# Altium project Ring Flex.PrjPcb
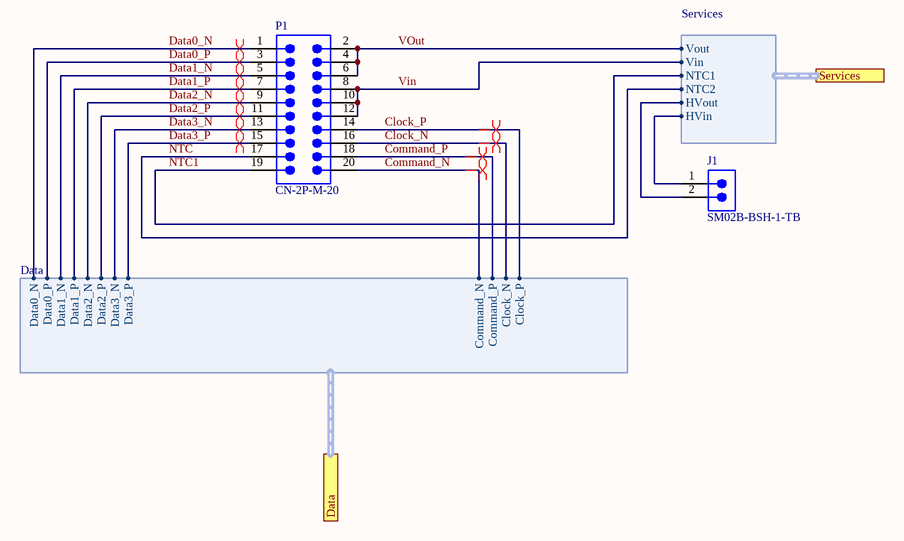
[diagram p0: Module Connector.SchDoc]
CERNProject: CERNProject; EDHNumber: EDHNumber; Group: PH-ADE-ID; ProjectAddress1: CH-1211 Genève 23 - Switzerland; ProjectOrganization: European Organization for Nuclear Research; ProjectTitle: ProjectTitle
3 sheets, 9 parts. Net scope: flat (ports and power ports of the same name join across sheets).
Board file: Ring Flex.PcbDoc
Sheets:
  Module Connector.SchDoc
  Ring Flex Connector.SchDoc
  Services.SchDoc

## Sheet Module Connector.SchDoc
size A

### Parts
(Parts that share a designator on the sheet are numbered #1, #2 ... from top to bottom, then left to right.)
J1  SM02B-BSH-1-TB  [SM02B-BSH-1-TB]
P1#1  CN-2P-M-20  [SLH-010-1.50-G-D-A]

### Ports
Data (harness Data), Services (harness Services)

### Harnesses
Services: Vin, Vout, HVin, HVout, NTC1, NTC2
Data: Data0_N, Data0_P, Data1_N, Data1_P, Data2_N, Data2_P, Data3_N, Data3_P, Clock_P, Clock_N, Command_P, Command_N

### Nets
Clock_N: P1#1.16 ; port Data.Clock_N
Clock_P: P1#1.14 ; port Data.Clock_P
Command_N: P1#1.20 ; port Data.Command_N
Command_P: P1#1.18 ; port Data.Command_P
Data0_N: P1#1.1 ; port Data.Data0_N
Data0_P: P1#1.3 ; port Data.Data0_P
Data1_N: P1#1.5 ; port Data.Data1_N
Data1_P: P1#1.7 ; port Data.Data1_P
Data2_N: P1#1.9 ; port Data.Data2_N
Data2_P: P1#1.11 ; port Data.Data2_P
Data3_N: P1#1.13 ; port Data.Data3_N
Data3_P: P1#1.15 ; port Data.Data3_P
NTC: P1#1.17 ; port Services.NTC2
NTC1: P1#1.19 ; port Services.NTC1
Vin: P1#1.8 P1#1.10 P1#1.12 ; port Services.Vin
VOut: P1#1.2 P1#1.4 P1#1.6 ; port Services.Vout
NetJ1_1: J1.1 ; port Services.HVin
NetJ1_2: J1.2 ; port Services.HVout

### Layout directives
differential pair: Clock_N, Clock_P, Command_N, Command_P, Data0_N, Data0_P, Data1_N, Data1_P, Data2_N, Data2_P, Data3_N, Data3_P

### Library data of the parts
J1 = CN-1S-M-2: 1 Row, Socket, 0 Mounting Holes, Male Pins, 2 Pins
P1#1 = CN-2P-M-20: Board-to-Board Connector, Vertical, 2-Row, Pitch 0.80mm, 20-Position, Male

## Sheet Ring Flex Connector.SchDoc
size A2
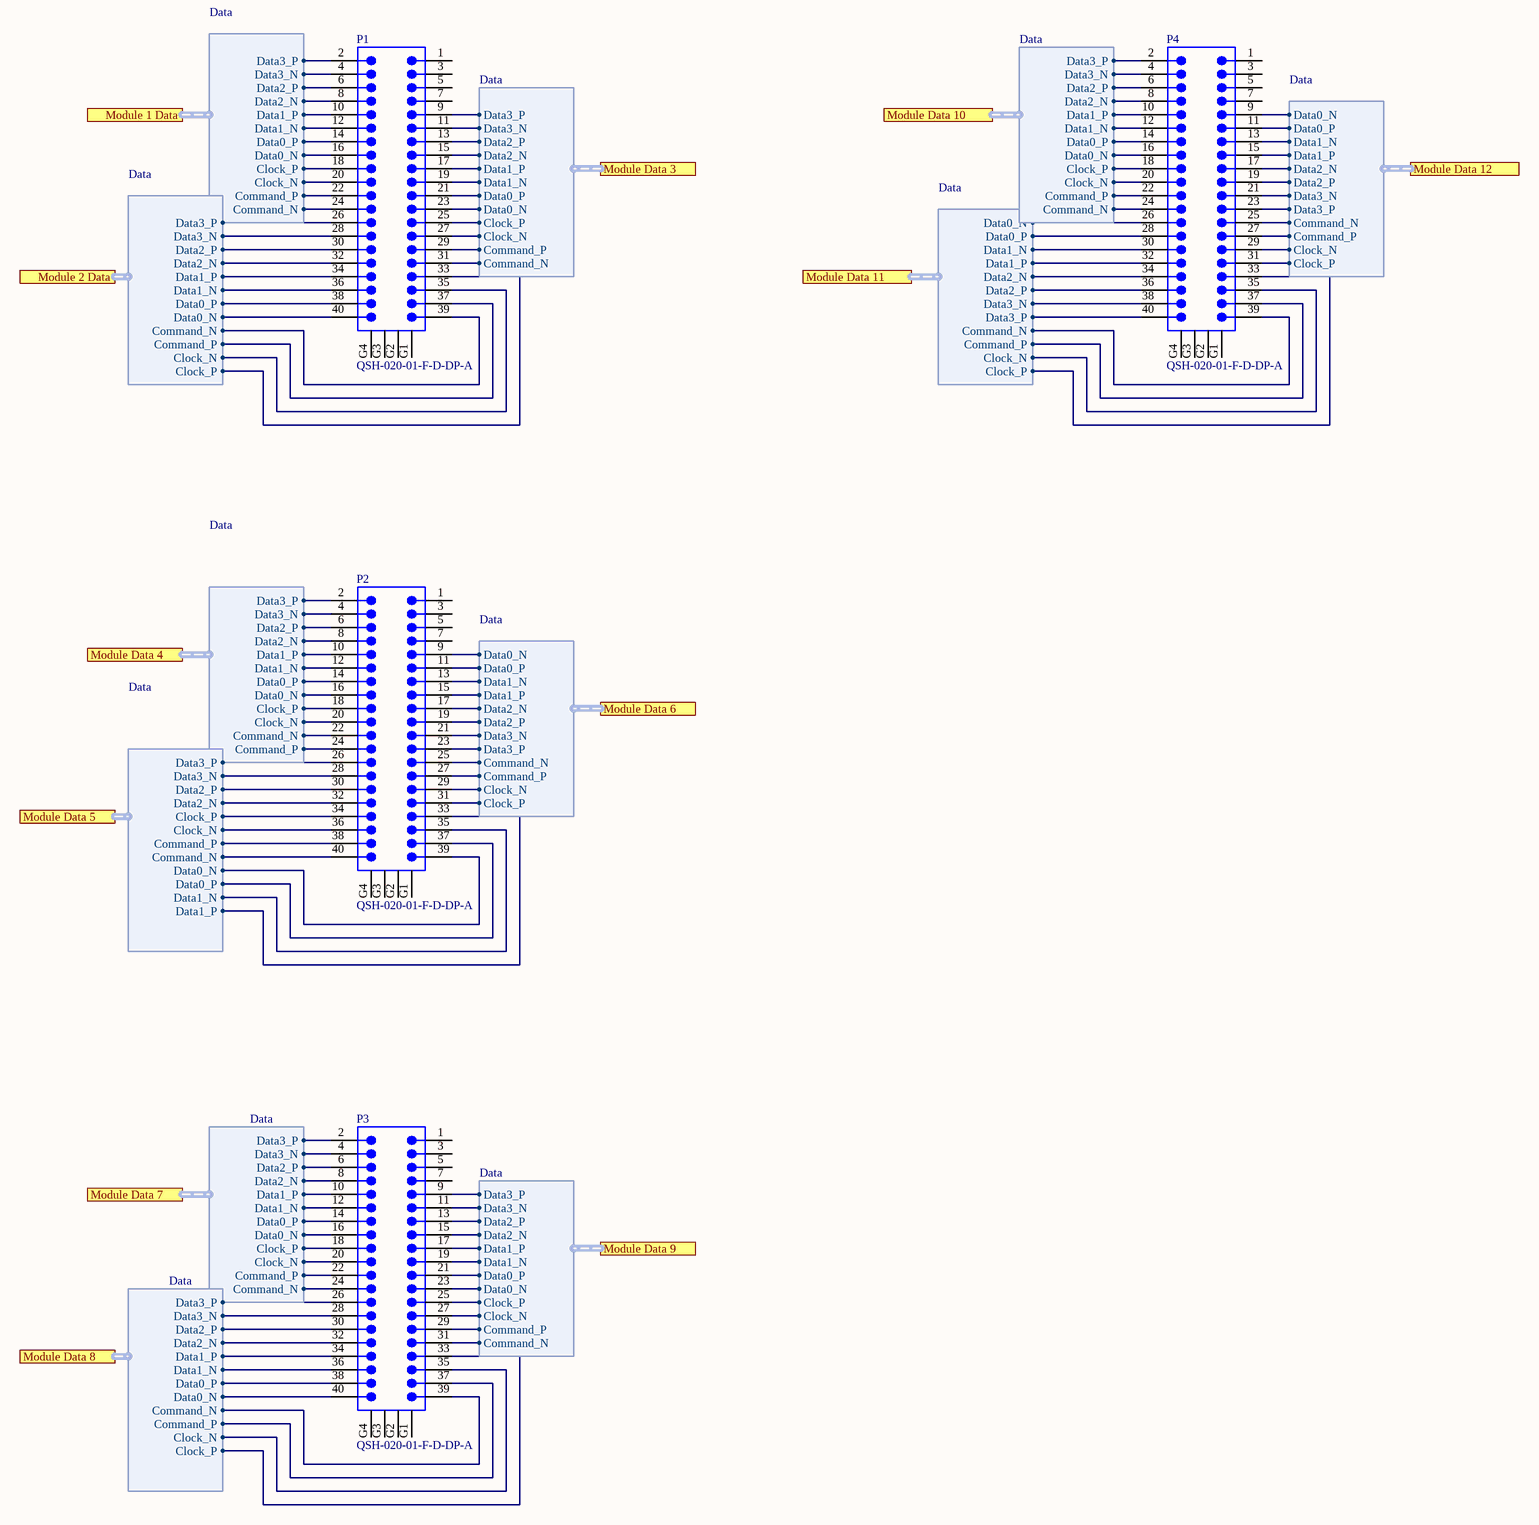
[diagram p1: Ring Flex Connector.SchDoc]

### Parts
(Parts that share a designator on the sheet are numbered #1, #2 ... from top to bottom, then left to right.)
P1#2  QSH-020-01-F-D-DP-A  [QSH-020-01-X-D-DP-A]
P2  QSH-020-01-F-D-DP-A  [QSH-020-01-X-D-DP-A]
P3  QSH-020-01-F-D-DP-A  [QSH-020-01-X-D-DP-A]
P4  QSH-020-01-F-D-DP-A  [QSH-020-01-X-D-DP-A]

### Ports
Module 1 Data (harness Data), Module 2 Data (harness Data), Module Data 3 (harness Data), Module Data 4 (harness Data), Module Data 5 (harness Data), Module Data 6 (harness Data), Module Data 7 (harness Data), Module Data 8 (harness Data), Module Data 9 (harness Data), Module Data 10 (harness Data), Module Data 11 (harness Data), Module Data 12 (harness Data)

### Harnesses
Data: Data0_N, Data0_P, Data1_N, Data1_P, Data2_N, Data2_P, Data3_N, Data3_P, Clock_P, Clock_N, Command_P, Command_N

### Nets
NetP1#2_2: P1#2.2 ; port Module 1 Data.Data3_P
NetP1#2_4: P1#2.4 ; port Module 1 Data.Data3_N
NetP1#2_6: P1#2.6 ; port Module 1 Data.Data2_P
NetP1#2_8: P1#2.8 ; port Module 1 Data.Data2_N
NetP1#2_9: P1#2.9 ; port Module Data 3.Data3_P
NetP1#2_10: P1#2.10 ; port Module 1 Data.Data1_P
NetP1#2_11: P1#2.11 ; port Module Data 3.Data3_N
NetP1#2_12: P1#2.12 ; port Module 1 Data.Data1_N
NetP1#2_13: P1#2.13 ; port Module Data 3.Data2_P
NetP1#2_14: P1#2.14 ; port Module 1 Data.Data0_P
NetP1#2_15: P1#2.15 ; port Module Data 3.Data2_N
NetP1#2_16: P1#2.16 ; port Module 1 Data.Data0_N
NetP1#2_17: P1#2.17 ; port Module Data 3.Data1_P
NetP1#2_18: P1#2.18 ; port Module 1 Data.Clock_P
NetP1#2_19: P1#2.19 ; port Module Data 3.Data1_N
NetP1#2_20: P1#2.20 ; port Module 1 Data.Clock_N
NetP1#2_21: P1#2.21 ; port Module Data 3.Data0_P
NetP1#2_22: P1#2.22 ; port Module 1 Data.Command_P
NetP1#2_23: P1#2.23 ; port Module Data 3.Data0_N
NetP1#2_24: P1#2.24 ; port Module 1 Data.Command_N
NetP1#2_25: P1#2.25 ; port Module Data 3.Clock_P
NetP1#2_26: P1#2.26 ; port Module 2 Data.Data3_P
NetP1#2_27: P1#2.27 ; port Module Data 3.Clock_N
NetP1#2_28: P1#2.28 ; port Module 2 Data.Data3_N
NetP1#2_29: P1#2.29 ; port Module Data 3.Command_P
NetP1#2_30: P1#2.30 ; port Module 2 Data.Data2_P
NetP1#2_31: P1#2.31 ; port Module Data 3.Command_N
NetP1#2_32: P1#2.32 ; port Module 2 Data.Data2_N
NetP1#2_33: P1#2.33 ; port Module 2 Data.Clock_P
NetP1#2_34: P1#2.34 ; port Module 2 Data.Data1_P
NetP1#2_35: P1#2.35 ; port Module 2 Data.Clock_N
NetP1#2_36: P1#2.36 ; port Module 2 Data.Data1_N
NetP1#2_37: P1#2.37 ; port Module 2 Data.Command_P
NetP1#2_38: P1#2.38 ; port Module 2 Data.Data0_P
NetP1#2_39: P1#2.39 ; port Module 2 Data.Command_N
NetP1#2_40: P1#2.40 ; port Module 2 Data.Data0_N
NetP2_2: P2.2 ; port Module Data 4.Data3_P
NetP2_4: P2.4 ; port Module Data 4.Data3_N
NetP2_6: P2.6 ; port Module Data 4.Data2_P
NetP2_8: P2.8 ; port Module Data 4.Data2_N
NetP2_9: P2.9 ; port Module Data 6.Data0_N
NetP2_10: P2.10 ; port Module Data 4.Data1_P
NetP2_11: P2.11 ; port Module Data 6.Data0_P
NetP2_12: P2.12 ; port Module Data 4.Data1_N
NetP2_13: P2.13 ; port Module Data 6.Data1_N
NetP2_14: P2.14 ; port Module Data 4.Data0_P
NetP2_15: P2.15 ; port Module Data 6.Data1_P
NetP2_16: P2.16 ; port Module Data 4.Data0_N
NetP2_17: P2.17 ; port Module Data 6.Data2_N
NetP2_18: P2.18 ; port Module Data 4.Clock_P
NetP2_19: P2.19 ; port Module Data 6.Data2_P
NetP2_20: P2.20 ; port Module Data 4.Clock_N
NetP2_21: P2.21 ; port Module Data 6.Data3_N
NetP2_22: P2.22 ; port Module Data 4.Command_N
NetP2_23: P2.23 ; port Module Data 6.Data3_P
NetP2_24: P2.24 ; port Module Data 4.Command_P
NetP2_25: P2.25 ; port Module Data 6.Command_N
NetP2_26: P2.26 ; port Module Data 5.Data3_P
NetP2_27: P2.27 ; port Module Data 6.Command_P
NetP2_28: P2.28 ; port Module Data 5.Data3_N
NetP2_29: P2.29 ; port Module Data 6.Clock_N
NetP2_30: P2.30 ; port Module Data 5.Data2_P
NetP2_31: P2.31 ; port Module Data 6.Clock_P
NetP2_32: P2.32 ; port Module Data 5.Data2_N
NetP2_33: P2.33 ; port Module Data 5.Data1_P
NetP2_34: P2.34 ; port Module Data 5.Clock_P
NetP2_35: P2.35 ; port Module Data 5.Data1_N
NetP2_36: P2.36 ; port Module Data 5.Clock_N
NetP2_37: P2.37 ; port Module Data 5.Data0_P
NetP2_38: P2.38 ; port Module Data 5.Command_P
NetP2_39: P2.39 ; port Module Data 5.Data0_N
NetP2_40: P2.40 ; port Module Data 5.Command_N
NetP3_2: P3.2 ; port Module Data 7.Data3_P
NetP3_4: P3.4 ; port Module Data 7.Data3_N
NetP3_6: P3.6 ; port Module Data 7.Data2_P
NetP3_8: P3.8 ; port Module Data 7.Data2_N
NetP3_9: P3.9 ; port Module Data 9.Data3_P
NetP3_10: P3.10 ; port Module Data 7.Data1_P
NetP3_11: P3.11 ; port Module Data 9.Data3_N
NetP3_12: P3.12 ; port Module Data 7.Data1_N
NetP3_13: P3.13 ; port Module Data 9.Data2_P
NetP3_14: P3.14 ; port Module Data 7.Data0_P
NetP3_15: P3.15 ; port Module Data 9.Data2_N
NetP3_16: P3.16 ; port Module Data 7.Data0_N
NetP3_17: P3.17 ; port Module Data 9.Data1_P
NetP3_18: P3.18 ; port Module Data 7.Clock_P
NetP3_19: P3.19 ; port Module Data 9.Data1_N
NetP3_20: P3.20 ; port Module Data 7.Clock_N
NetP3_21: P3.21 ; port Module Data 9.Data0_P
NetP3_22: P3.22 ; port Module Data 7.Command_P
NetP3_23: P3.23 ; port Module Data 9.Data0_N
NetP3_24: P3.24 ; port Module Data 7.Command_N
NetP3_25: P3.25 ; port Module Data 9.Clock_P
NetP3_26: P3.26 ; port Module Data 8.Data3_P
NetP3_27: P3.27 ; port Module Data 9.Clock_N
NetP3_28: P3.28 ; port Module Data 8.Data3_N
NetP3_29: P3.29 ; port Module Data 9.Command_P
NetP3_30: P3.30 ; port Module Data 8.Data2_P
NetP3_31: P3.31 ; port Module Data 9.Command_N
NetP3_32: P3.32 ; port Module Data 8.Data2_N
NetP3_33: P3.33 ; port Module Data 8.Clock_P
NetP3_34: P3.34 ; port Module Data 8.Data1_P
NetP3_35: P3.35 ; port Module Data 8.Clock_N
NetP3_36: P3.36 ; port Module Data 8.Data1_N
NetP3_37: P3.37 ; port Module Data 8.Command_P
NetP3_38: P3.38 ; port Module Data 8.Data0_P
NetP3_39: P3.39 ; port Module Data 8.Command_N
NetP3_40: P3.40 ; port Module Data 8.Data0_N
NetP4_2: P4.2 ; port Module Data 10.Data3_P
NetP4_4: P4.4 ; port Module Data 10.Data3_N
NetP4_6: P4.6 ; port Module Data 10.Data2_P
NetP4_8: P4.8 ; port Module Data 10.Data2_N
NetP4_9: P4.9 ; port Module Data 12.Data0_N
NetP4_10: P4.10 ; port Module Data 10.Data1_P
NetP4_11: P4.11 ; port Module Data 12.Data0_P
NetP4_12: P4.12 ; port Module Data 10.Data1_N
NetP4_13: P4.13 ; port Module Data 12.Data1_N
NetP4_14: P4.14 ; port Module Data 10.Data0_P
NetP4_15: P4.15 ; port Module Data 12.Data1_P
NetP4_16: P4.16 ; port Module Data 10.Data0_N
NetP4_17: P4.17 ; port Module Data 12.Data2_N
NetP4_18: P4.18 ; port Module Data 10.Clock_P
NetP4_19: P4.19 ; port Module Data 12.Data2_P
NetP4_20: P4.20 ; port Module Data 10.Clock_N
NetP4_21: P4.21 ; port Module Data 12.Data3_N
NetP4_22: P4.22 ; port Module Data 10.Command_P
NetP4_23: P4.23 ; port Module Data 12.Data3_P
NetP4_24: P4.24 ; port Module Data 10.Command_N
NetP4_25: P4.25 ; port Module Data 12.Command_N
NetP4_26: P4.26 ; port Module Data 11.Data0_N
NetP4_27: P4.27 ; port Module Data 12.Command_P
NetP4_28: P4.28 ; port Module Data 11.Data0_P
NetP4_29: P4.29 ; port Module Data 12.Clock_N
NetP4_30: P4.30 ; port Module Data 11.Data1_N
NetP4_31: P4.31 ; port Module Data 12.Clock_P
NetP4_32: P4.32 ; port Module Data 11.Data1_P
NetP4_33: P4.33 ; port Module Data 11.Clock_P
NetP4_34: P4.34 ; port Module Data 11.Data2_N
NetP4_35: P4.35 ; port Module Data 11.Clock_N
NetP4_36: P4.36 ; port Module Data 11.Data2_P
NetP4_37: P4.37 ; port Module Data 11.Command_P
NetP4_38: P4.38 ; port Module Data 11.Data3_N
NetP4_39: P4.39 ; port Module Data 11.Command_N
NetP4_40: P4.40 ; port Module Data 11.Data3_P

Not connected (* = marked no-connect by the designer): P1#2 1 3 5 7 G1 G2 G3 G4; P2 1 3 5 7 G1 G2 G3 G4; P3 1 3 5 7 G1 G2 G3 G4; P4 1 3 5 7 G1 G2 G3 G4

### Notes on the sheet
- Title
- Size:
- Date:
- File:
- A2
- Number:
- Time:
- Revision:
- Sheet
- of

### Library data of the parts
P1#2 P2-P4 = CN-2P-M-40: Board-to-Board Connector, Differnetial Pair, Vertical, 2-Row, Pitch 0.50mm, 40-Position, Male

## Sheet Services.SchDoc
size A0; Organization: Altium Limited; Address1: L3, 12a Rodborough Rd; Address2: Frenchs Forest; Address3: NSW; Address4: Australia 2086
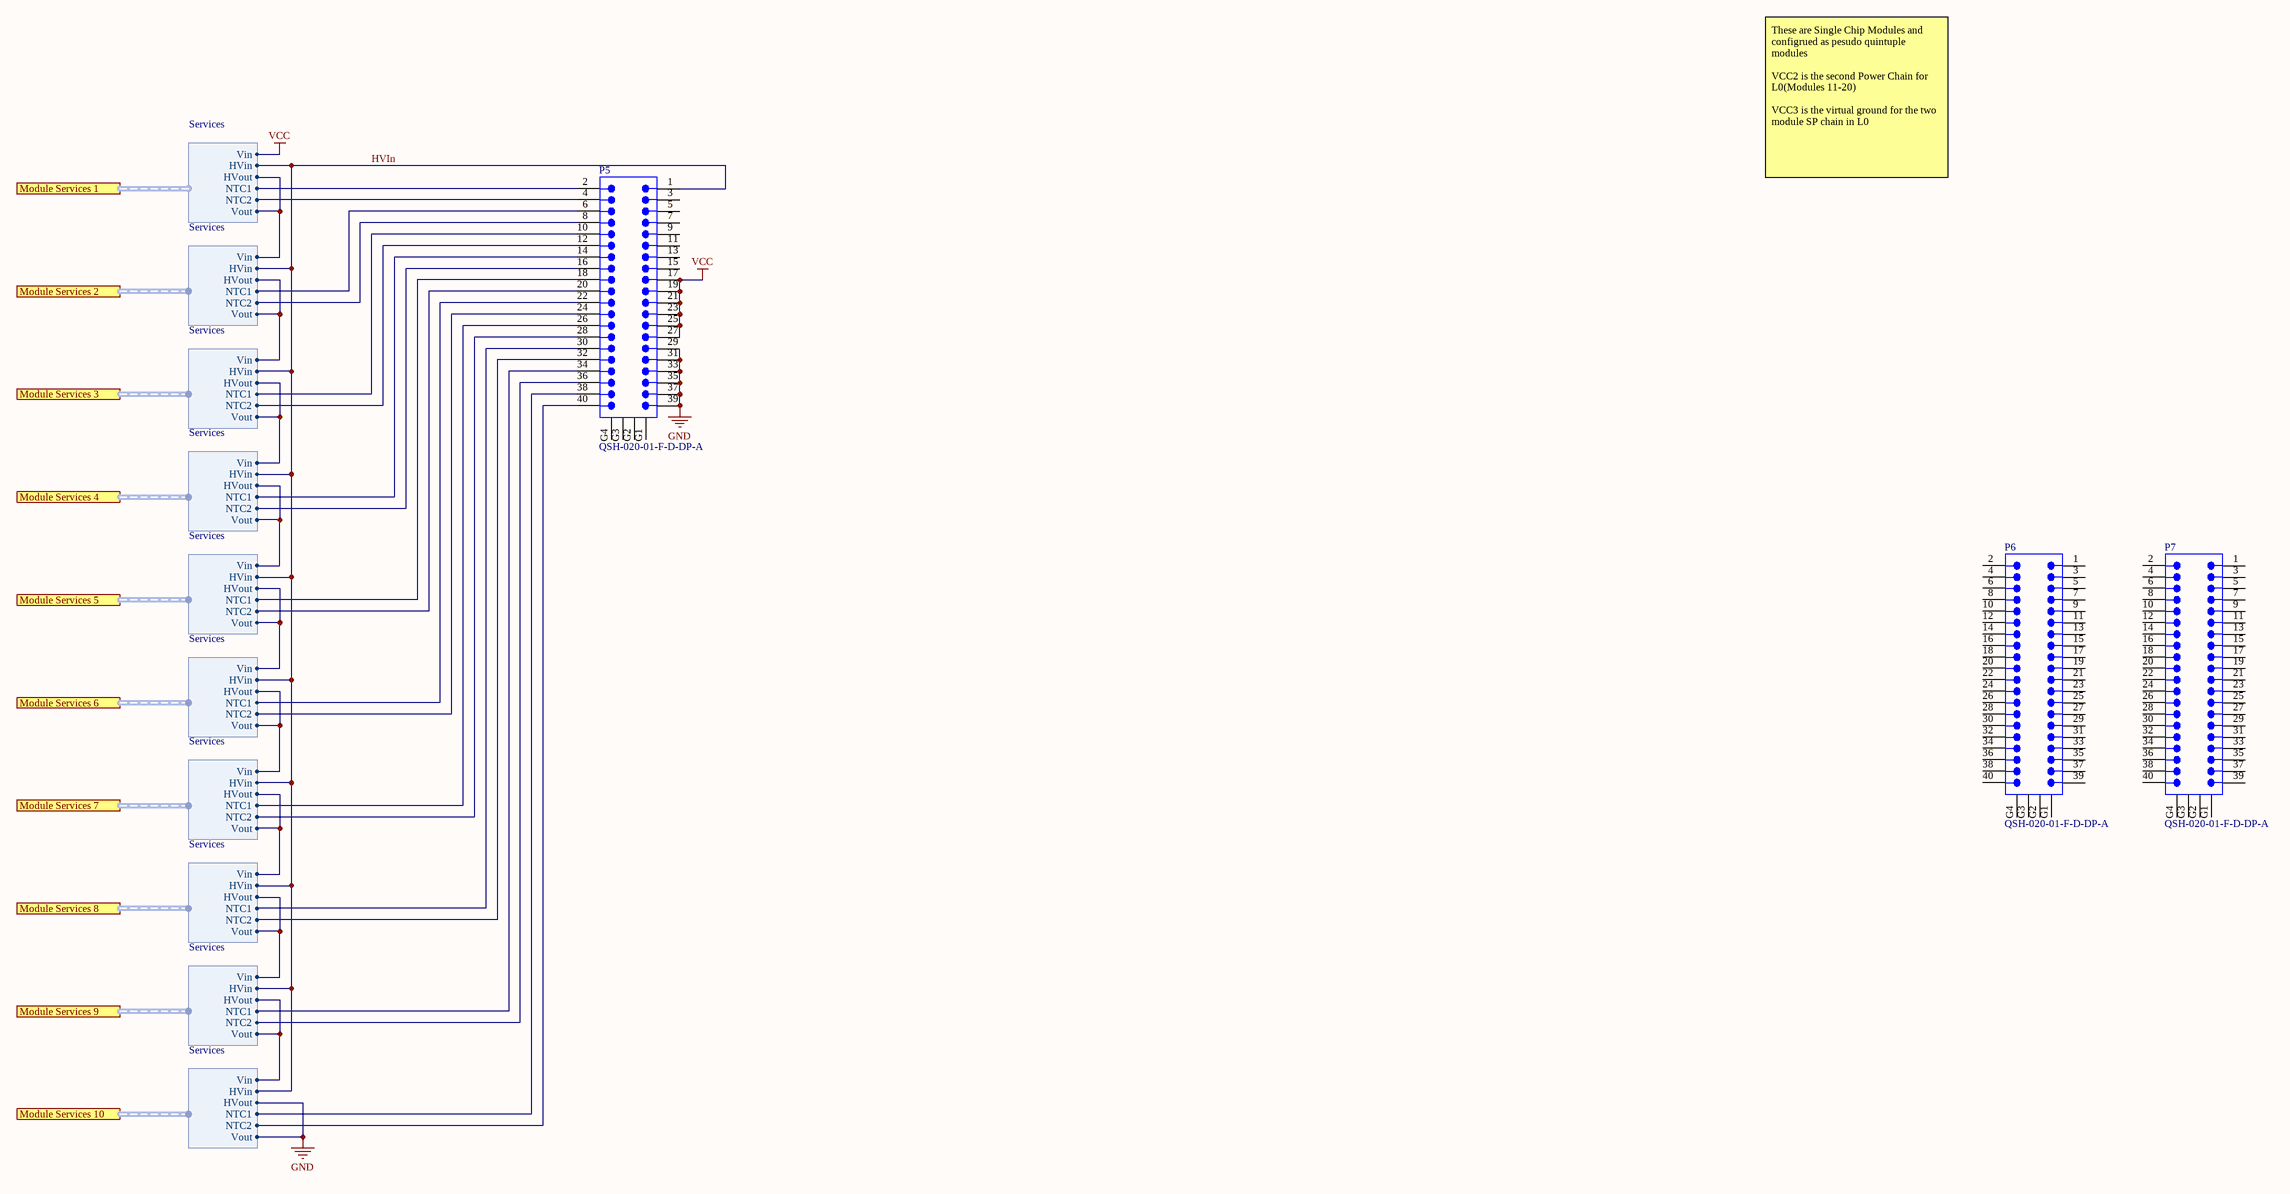
[diagram p2: Services.SchDoc]

### Parts
P5  QSH-020-01-F-D-DP-A  [QSH-020-01-X-D-DP-A]
P6  QSH-020-01-F-D-DP-A  [QSH-020-01-X-D-DP-A]
P7  QSH-020-01-F-D-DP-A  [QSH-020-01-X-D-DP-A]

### Ports
Module Services 1 (harness Services), Module Services 2 (harness Services), Module Services 3 (harness Services), Module Services 4 (harness Services), Module Services 5 (harness Services), Module Services 6 (harness Services), Module Services 7 (harness Services), Module Services 8 (harness Services), Module Services 9 (harness Services), Module Services 10 (harness Services)

### Harnesses
Services: Vin, Vout, HVin, HVout, NTC1, NTC2

### Nets
GND: P5.29 P5.31 P5.33 P5.35 P5.37 P5.39 ; port Module Services 10.Vout, port Module Services 10.HVout
VCC: P5.17 P5.19 P5.21 P5.23 P5.25 P5.27 ; port Module Services 1.Vin
HVIn: P5.1 ; port Module Services 1.HVin, port Module Services 2.HVin, port Module Services 3.HVin, port Module Services 4.HVin, port Module Services 5.HVin, port Module Services 6.HVin, port Module Services 7.HVin, port Module Services 8.HVin, port Module Services 9.HVin, port Module Services 10.HVin
NetP5_2: P5.2 ; port Module Services 1.NTC1
NetP5_4: P5.4 ; port Module Services 1.NTC2
NetP5_6: P5.6 ; port Module Services 2.NTC1
NetP5_8: P5.8 ; port Module Services 2.NTC2
NetP5_10: P5.10 ; port Module Services 3.NTC1
NetP5_12: P5.12 ; port Module Services 3.NTC2
NetP5_14: P5.14 ; port Module Services 4.NTC1
NetP5_16: P5.16 ; port Module Services 4.NTC2
NetP5_18: P5.18 ; port Module Services 5.NTC1
NetP5_20: P5.20 ; port Module Services 5.NTC2
NetP5_22: P5.22 ; port Module Services 6.NTC1
NetP5_24: P5.24 ; port Module Services 6.NTC2
NetP5_26: P5.26 ; port Module Services 7.NTC1
NetP5_28: P5.28 ; port Module Services 7.NTC2
NetP5_30: P5.30 ; port Module Services 8.NTC1
NetP5_32: P5.32 ; port Module Services 8.NTC2
NetP5_34: P5.34 ; port Module Services 9.NTC1
NetP5_36: P5.36 ; port Module Services 9.NTC2
NetP5_38: P5.38 ; port Module Services 10.NTC1
NetP5_40: P5.40 ; port Module Services 10.NTC2
(unnamed): port Module Services 1.Vout, port Module Services 1.HVout, port Module Services 2.Vin
(unnamed): port Module Services 2.Vout, port Module Services 2.HVout, port Module Services 3.Vin
(unnamed): port Module Services 3.Vout, port Module Services 3.HVout, port Module Services 4.Vin
(unnamed): port Module Services 4.Vout, port Module Services 4.HVout, port Module Services 5.Vin
(unnamed): port Module Services 5.Vout, port Module Services 5.HVout, port Module Services 6.Vin
(unnamed): port Module Services 6.Vout, port Module Services 6.HVout, port Module Services 7.Vin
(unnamed): port Module Services 7.Vout, port Module Services 7.HVout, port Module Services 8.Vin
(unnamed): port Module Services 8.Vout, port Module Services 8.HVout, port Module Services 9.Vin
(unnamed): port Module Services 9.Vout, port Module Services 9.HVout, port Module Services 10.Vin

Not connected (* = marked no-connect by the designer): P5 3 5 7 9 11 13 15 G1 G2 G3 G4; P6 1 2 3 4 5 6 7 8 9 10 11 12 13 14 15 16 17 18 19 20 21(20) 22(21) 23(21) 24(22) 25(22) 26(23) 27(23) 28(24) 29(24) 30(25) 31(25) 32(26) 33(26) 34(27) 35(27) 36(28) 37(28) 38(29) 39(29) 40(30) G1 G2 G3 G4; P7 1 2 3 4 5 6 7 8 9 10 11 12 13 14 15 16 17 18 19 20 21(20) 22(21) 23(21) 24(22) 25(22) 26(23) 27(23) 28(24) 29(24) 30(25) 31(25) 32(26) 33(26) 34(27) 35(27) 36(28) 37(28) 38(29) 39(29) 40(30) G1 G2 G3 G4

### Notes on the sheet
- These are Single Chip Modules and configrued as pesudo quintuple modules
  VCC2 is the second Power Chain for L0(Modules 11-20)
  VCC3 is the virtual ground for the two module SP chain in L0
- Title
- Size:
- Date:
- File:
- A0
- Number:
- Time:
- Revision:
- Sheet
- of

### Library data of the parts
P5-P7 = CN-2P-M-40: as P1#2 on sheet Ring Flex Connector